# Altium project ECE453-Base.PrjPcb
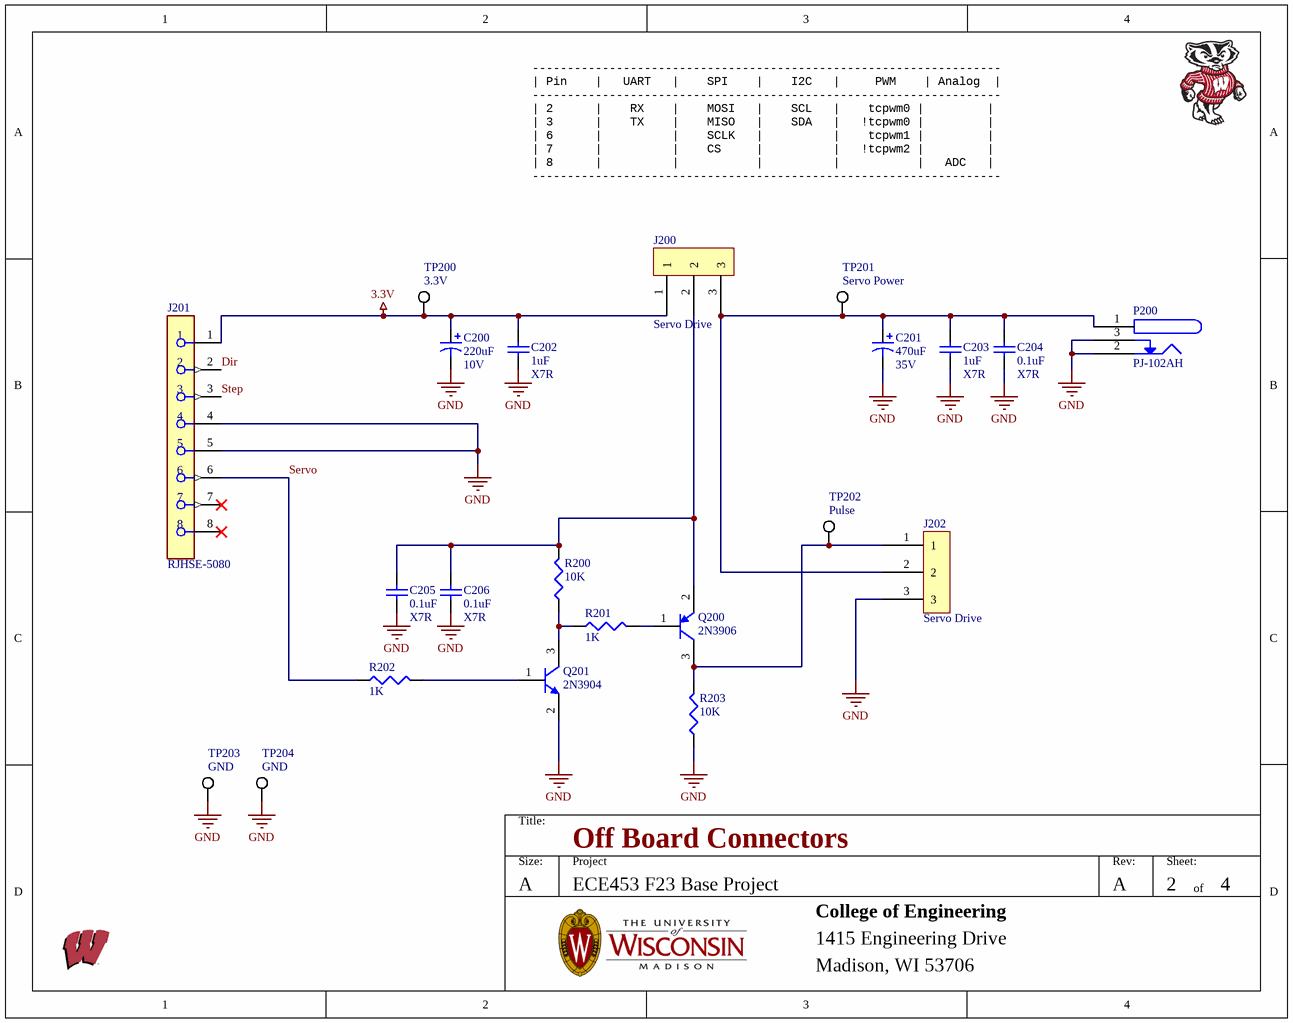
[diagram p0: 02_Connectors.SchDoc]
3 sheets, 75 parts. Net scope: global (net labels, ports and power ports of the same name join across sheets).
Board file: ECE453.PcbDoc
Sheets:
  02_Connectors.SchDoc
  03_ICs.SchDoc
  04_Mechanical.SchDoc

## Sheet 02_Connectors.SchDoc: Off Board Connectors
size A; Revision: A; SheetNumber: 2; SheetTotal: 4; ECE315_Project_Name: ECE453 F23 Base Project

### Parts
C200  Voltage: 10V  [CAPPR2-5x11]  (hidden comment: 220uF)
C201  Voltage: 35V  [CAPPR5-10x12.5]  (hidden comment: 470uF)
C202  Dielectric: X7R  [CAPC2012M]  (hidden comment: 1uF)
C203  Dielectric: X7R  [CAPC2012M]  (hidden comment: 1uF)
C204  Dielectric: X7R  [CAPC2012M]  (hidden comment: 0.1uF)
C205  Dielectric: X7R  [CAPC2012M]  (hidden comment: 0.1uF)
C206  Dielectric: X7R  [CAPC2012M]  (hidden comment: 0.1uF)
J200  Servo Drive  [3X1HDR]
J201  RJHSE-5080  [FP-RJHSE-5080-MFG]
J202  Servo Drive  [3X1HDR]
P200  Manufacturer Part Number: PJ-102AH  [PJ-102]  (hidden comment: PJ-102)
Q200  2N3906  [SOT23-3M]
Q201  2N3904  [SOT23-3M]
R200  10K  [RES_0805]
R201  value 1K  [RES_0805]  (hidden comment: 10K)
R202  value 1K  [RES_0805]  (hidden comment: 10K)
R203  10K  [RES_0805]
TP200  3.3V  [KSTN-5019_V]
TP201  Servo Power  [KSTN-5019_V]
TP202  Pulse  [KSTN-5019_V]
TP203  GND  [KSTN-5019_V]
TP204  GND  [KSTN-5019_V]

### Nets
3.3V: C200.1 C202.1 J200.1 J201.1 TP200.1
GND: C200.2 C201.2 C202.2 C203.1 C204.2 C205.2 C206.2 J201.4 J201.5 J202.3 P200.2 P200.3 Q201.2(E) R203.1 TP203.1 TP204.1
Dir: J201.2
Servo: J201.6 R202.1
Step: J201.3
NetC201_1: C201.1 C203.2 C204.1 J200.3 J202.2 P200.1 TP201.1
NetC205_1: C205.1 C206.1 J200.2 Q200.2(E) R200.2
NetJ202_1: J202.1 Q200.3(C) R203.2 TP202.1
NetQ200_1: Q200.1(B) R201.2
NetQ201_1: Q201.1(B) R202.2
NetQ201_3: Q201.3(C) R200.1 R201.1

Not connected (* = marked no-connect by the designer): J201 7* 8*

### Notes on the sheet
- -------------------------------------------------------------------
  | Pin    |   UART   |    SPI    |    I2C   |     PWM    | Analog  |
  -------------------------------------------------------------------
  | 2      |    RX    |    MOSI   |    SCL   |    tcpwm0 |         |
  | 3      |    TX    |    MISO   |    SDA   |   !tcpwm0 |         |
  | 6      |          |    SCLK   |          |    tcpwm1 |         |
  | 7      |          |    CS     |          |   !tcpwm2 |         |
  | 8      |          |           |          |           |   ADC   |
  -------------------------------------------------------------------
- Title:
- Size:
- A
- Project
- Rev:
- Sheet:
- of
- College of Engineering
- 1415 Engineering Drive
- Madison, WI 53706

### Library data of the parts
C200 = Cap Pol1_1: Capacitor Al 105deg 220uF 10V 5X11; Manufacturer: Rubycon; Manufacturer Part Number: 10YXJ220M5X11; Tolerance: 20%; Ripple Current: 250mA; Impedance: 400mR; Leakage Current: 3uA; Life (Hours): 4000Hour; Lead Diameter: 0.5mm; Value: 220uF; Supplier: Digi-Key; Supplier Part Number: 1189-4150-ND; RoHS: Yes; Category: Aluminum Electrolytic Capacitors; Stock 1: 94; Pricing 1: 1=0.26000, 10=0.17500, 50=0.11680, 100=0.09930, 500=0.07010, 1000=0.06134, 2500=0.05842, 5000=0.05404 (USD); Mount: Through Hole; Case/Package: Radial; Min Operating Temperature: -40°C; Max Operating Temperature: 105°C; Capacitance: 220uF; Termination: Radial; Package Quantity: 3000; Packaging: Bulk; Voltage Rating: 10V; Series: YXJ; Construction: RADIAL; Diameter: 5mm; Height: 11mm; Lead Pitch: 2mm; Height - Seated (Max): 0.492inch; Radiation Hardening: No; RoHS Compliant: Yes; ComponentLink1URL: https://datasheet.ciiva.com/11777/0900766b810307a1-11777018.pdf?src-supplier=RSComponents; ComponentLink1Description: https://datasheet.ciiva.com/11777/0900766b810307a1-11777018.pdf?src-supplier=RSComponents; ComponentLink2URL: https://datasheet.ciiva.com/6318/e-yxj-6318863.pdf?src-supplier=Digi-Key; ComponentLink2Description: https://datasheet.ciiva.com/6318/e-yxj-6318863.pdf?src-supplier=Digi-Key; ComponentLink3URL: https://datasheet.ciiva.com/11690/e-yxj-11690699.pdf?src-supplier=Avnet; ComponentLink3Description: https://datasheet.ciiva.com/11690/e-yxj-11690699.pdf?src-supplier=Avnet
C201 = Cap Pol3_1: CAP ALUM 470UF 20% 35V RADIAL; Manufacturer: Rubycon; Manufacturer Part Number: 35ZL470MEFC10X20; Leakage Current: 3uA; Lead Diameter: 0.6mm; Dielectric Material: Aluminium; Life (Hours): 4000Hour; Ripple Current: 1.82A; Impedance: 23mR; Value: 470uF; Case/Package: Radial; Max Operating Temperature: 105°C; REACH SVHC: Unknown; Min Operating Temperature: -40°C; Supplier Part Number: 35ZL470MEFC10X20-ND; Packaging: Bulk; Lead Pitch: 5mm; Diameter: 10mm; Capacitance: 470uF; Lead Free: Lead Free; Radiation Hardening: No; Package Quantity: 1000; Height: 20mm; Voltage Rating: 35V; Mount: Through Hole; Supplier: Digi-Key; Height - Seated (Max): 0.866inch; Tolerance: 20%; Termination: Radial
C202 = Cap_5: CAP CER 1UF 50V X7R 0805; Manufacturer: Samsung; Manufacturer Part Number: CL21B105KBFNNNE; Tolerance: 10%; Dielectric Material: Ceramic; Value: 1uF; Case Code (Metric): 2012; Min Operating Temperature: -55°C; Mount: Surface Mount; Width: 0.049inch; Voltage Rating (DC): 50V; Voltage Rating: 50V; Height: 1.25mm; Case Code (Imperial): 0805; Supplier: Digi-Key; Supplier Part Number: 1276-1029-6-ND; Capacitance: 1uF; Case/Package: 0805; Construction: Flat; Max Operating Temperature: 125°C; REACH SVHC: No SVHC; Voltage: 50V; Packaging: Tape and Reel; Depth: 1.25mm; Package Quantity: 1; Radiation Hardening: No; Series: CL; Length: 2mm; Thickness: 0.053inch; Termination: SMD/SMT; Number of Pins: 2; RoHS Compliant: Yes
C203 = Cap: CAP CER 1UF 50V X7R 0805; Manufacturer: Samsung; Manufacturer Part Number: CL21B105KBFNNNE; Tolerance: 10%; Dielectric Material: Ceramic; Case Code (Metric): 2012; Min Operating Temperature: -55°C; Mount: Surface Mount; Width: 0.049inch; Voltage Rating (DC): 50V; Voltage Rating: 50V; Height: 1.25mm; Case Code (Imperial): 0805; Supplier: Digi-Key; Supplier Part Number: 1276-1029-6-ND; Capacitance: 1uF; Case/Package: 0805; Construction: Flat; Max Operating Temperature: 125°C; REACH SVHC: No SVHC; Voltage: 50V; Packaging: Tape and Reel; Depth: 1.25mm; Package Quantity: 1; Radiation Hardening: No; Series: CL; Length: 2mm; Thickness: 0.053inch; Termination: SMD/SMT; Number of Pins: 2; RoHS Compliant: Yes; Value: 1uF
C204-C206 = Cap_1: Cap Ceramic 0.1uF 50V X7R 20% SMD 0805 125°C Plastic T/R; Manufacturer: KEMET; Manufacturer Part Number: C0805C104M5RAC7210; Supplier: Digi-Key; Supplier Part Number: 399-C0805C104M5RAC7210CT-ND; RoHS: Yes; Category: Ceramic Capacitors; Stock 1: 29705; Pricing 1: 1=0.10000, 10=0.05900, 50=0.03220, 100=0.02620, 500=0.01874, 1000=0.01472, 2500=0.01338, 5000=0.01231 (USD); Mounting Technology: Surface Mount; Case/Package: 0805; Dielectric Material: Ceramic; Min Operating Temperature: -55°C; Max Operating Temperature: 125°C; Packaging: Tape and Reel; Tolerance: 20%; Voltage Rating (DC): 50V; Construction: Flat; Length: 2mm; Height: 0.9mm; Depth: 1.25mm; Radiation Hardening: No; RoHS Compliant: Yes; ComponentLink1URL: https://datasheet.ciiva.com/26923/getdatasheetpartid-738954-26923963.pdf?src-supplier=Verical; ComponentLink1Description: https://datasheet.ciiva.com/26923/getdatasheetpartid-738954-26923963.pdf?src-supplier=Verical; Value: 0.1uF
J200 J202 = 3-Pin_1: Switch Slide N.O./N.C. SPDT Top Slide 0.2A 30VDC PC Pins Thru-Hole; Manufacturer: E-Switch; Manufacturer Part Number: EG1218; Voltage Rating (DC): 30V; Electrical Life: 10000Cycles; Switch Travel: 2.5mm; Switch Function: On-On; Actuator Type: Standard; Contact Current Rating: 200mA; Operating Force: 250gf; Illumination Type: Non-Illuminated; Number of Positions: 2; Insulation Resistance: 100R; Contact Resistance: 20mR; Actuator Length: 2mm; Supplier 1: Digi-Key; Supplier Part Number 1: EG1903-ND; RoHS: Yes; Category: Slide Switches; Stock 1: 46638; Pricing 1: 1=0.74, 25=0.6664, 100=0.5958, 500=0.5047, 2500=0.42434 (USD); Mounting Technology: Through Hole; Pins: 3; Contact Material: Copper Alloy,Copper,Silver; Contact Plating: Silver; Min Operating Temperature: -20°C; Max Operating Temperature: 70°C; Throw Configuration: SPDT; Termination: PC Pin; Packaging: Bulk; Orientation: Straight; Series: EG; Voltage Rating (AC): 30V; Voltage Rating: 30V; Lead Free: Lead Free; RoHS Compliant: Yes; Reach SVHC Compliant: No; ComponentLink1URL: https://datasheet.ciiva.com/1699/p040040c-1699451.pdf?src-supplier=Newark; ComponentLink1Description: https://datasheet.ciiva.com/1699/p040040c-1699451.pdf?src-supplier=Newark
J201 = CMP-02366-000003-1: CONN MOD JACK 8P8C R/A UNSHLD; Manufacturer: Amphenol; Current Rating: 1.5A; Voltage Rating: 125V; Pitch: 1.02mm; Conn Orientation: Right Angle; Number Of Contacts: 8; Is Female: yes; Conn Gender: Female; Contact Resistance: 20mR; Number of Ports: 1; Connector Type: RJ45; Lead Free: Yes; Device Class L3: unset; Footprint Url: https://cdn.amphenol-icc.com/media/wysiwyg/files/drawing/rjhse5080.pdf?__cf_chl_jschl_tk__=e349db0bbbb6188a39347cd5e541b92fa02c9719-1587748343-0-AW7tChdeHzRPLX9gSWj7WrKaXQoY9BsmT9Ek0h-T62M9y3Rs9iypFcOtkzb-6sGYQEjFE-jcoNciDETCOZrh1rYyOesac5SvYLoLwHIsHvF4AKBlx-MXmfZUVk9OTTJLqyQq2qMm0PFRLJpNcK0nrKResqOniRSYixG2sPTmOPraH-ULJFBDL602CHqcI9KKBgTq90Jh1OL2Td4moJ99rFsJRJ1Tk_uoxGe8ublcP_ARu-uLpWcQrBcwOcHDTAwL29DAwVaqcH7ta8Ks7WMlHmVl_pILeEDwT0bE9vu5Pa5S3PtNRF1leuFkgi_FMbUxTDulc5xzbXSfng8srUIV1lWXny5nx1fZJEUa_w97yKjffzBMxiWLWVN-V7-uqAaPbyv_m-wRyw5O25OZNyJOeGU; ComponentLink2URL: https://cdn.amphenol-icc.com/media/wysiwyg/files/documentation/datasheet/inputoutput/io-modjack-rjhse.pdf; Device Class L1: Connectors; Package: CONN_MOD_JACK; Mouser Description: Modular Connectors / Ethernet Connectors R/A RJ45 NONSHIELDED 8 CONT NO LEDS; Manufacturer Part Number: RJHSE-5080; Octopart: https://octopart.com/rjhse-5080-amphenol-45060; Category: Conn; Height: 0.535inch; Temperature: -55°C to +85°C; Digikey Description: CONN MOD JACK 8P8C R/A UNSHLD; Device Class L2: Modular / Ethernet Connectors; Contact Material: Gold,Nickel; ComponentLink2Description: Datasheet; Temperature Range Low: -55°C; RoHS: TRUE; Automotive: No; Temperature Range High: +85°C; Supplier: Newark; Supplier Part Number: 28T0105; Stock: 8640; Pricing: 1=0.966, 10=0.854, 25=0.808, 50=0.777, 100=0.748, 250=0.688, 500=0.627, 1000=0.568 (USD); Mounting Technology: Through Hole,Panel; Contact Plating: Gold; Max Current Rating: 1.5A; Number of Positions Loaded: 8; Max Voltage Rating (AC): 125V; Orientation: Right Angle; Packaging: Rail/Tube; Gender: Female; Termination: Solder; Number of Positions: 8; Voltage Rating (DC): 125V; Length: 15.75mm; Depth: 14.99mm; Radiation Hardening: No; RoHS Compliant: Yes; Reach SVHC Compliant: Unknown; ComponentLink1URL: https://datasheet.ciiva.com/7629/1682821-7629402.pdf?src-supplier=Element14; ComponentLink1Description: https://datasheet.ciiva.com/7629/1682821-7629402.pdf?src-supplier=Element14; ComponentLink3URL: https://datasheet.ciiva.com/685/rjhse5080-685586.pdf?src-supplier=Digi-Key; ComponentLink3Description: https://datasheet.ciiva.com/685/rjhse5080-685586.pdf?src-supplier=Digi-Key; ComponentLink4URL: https://datasheet.ciiva.com/1432/1693748-1432448.pdf?src-supplier=Element14; ComponentLink4Description: https://datasheet.ciiva.com/1432/1693748-1432448.pdf?src-supplier=Element14; ComponentLink5URL: https://datasheet.ciiva.com/15171/getdatasheetpartid-643190-15171163.pdf?src-supplier=Verical; ComponentLink5Description: https://datasheet.ciiva.com/15171/getdatasheetpartid-643190-15171163.pdf?src-supplier=Verical
P200 = CONN JACK PWR W/SW: CONN PWR JACK 2.1X5.5MM HIGH CUR; Manufacturer: CUI Inc; Internal Switch(s): Single Switch, Normally Closed; Number of Positions/Contacts: 2 Conductors, 3 Contacts; Plug/Mating Plug Diameter: 2.1mm ID, 5.5mm OD; Gender: Male; Shielding: Unshielded; Voltage - Rated: 24VDC; Current Rating: 5A; Value: CP-102AD; Mounting Type: Through Hole, Right Angle; Supplier: Digi-Key; Connector Type: Jack; Supplier Part Number: CP-102AH-ND; Termination: Solder; Contact Material: Copper; Housing Material: Thermoplastic; Contact Material - Plating: Nickel; Housing Color: Black; Operating Temperature: -25°C ~ 85°C; Color: Black
Q200 = 2N3906: TRANS PNP 40V 0.2A SOT23; Manufacturer Part Number: MMBT3906LT1G; Manufacturer: ON Semiconductor; Current - Collector (Ic) (Max): 200mA; Vce Saturation (Max) @ Ib, Ic: 400mV @ 5mA, 50mA; DC Current Gain (hFE) (Min) @ Ic, Vce: 100 @ 10mA, 1V; Power - Max: 300mW; Frequency - Transition: 250MHz; Transistor Type: PNP; Category: Discrete Semiconductor Products; RoHS: RoHS Compliant; Supplier: Digi-Key; Supplier Part Number: MMBT3906LT1GOSCT-ND; Packaging: Cut Tape (CT); Voltage - Collector Emitter Breakdown (Max): 40V; Mounting Type: Surface Mount; Supplier Device Package: SOT-23-3 (TO-236); Package / Case: TO-236-3, SC-59, SOT-23-3; Value: 2N3906
Q201 = 2N3904: NPN General Purpose Amplifier; Manufacturer Part Number: MMBT3904-7-F; Manufacturer: Diodes Incorporated; Frequency - Transition: 300MHz; Power - Max: 300mW; DC Current Gain (hFE) (Min) @ Ic, Vce: 100 @ 10mA, 1V; Current - Collector Cutoff (Max): 50nA (ICBO); Vce Saturation (Max) @ Ib, Ic: 300mV @ 5mA, 50mA; Voltage - Collector Emitter Breakdown (Max): 40V; Current - Collector (Ic) (Max): 200mA; Supplier Device Package: SOT-23-3; Mounting Type: Surface Mount; Transistor Type: NPN; Packaging: Cut Tape (CT); RoHS: RoHS Compliant; Package / Case: TO-236-3, SC-59, SOT-23-3; Supplier Part Number: MMBT3904-FDICT-ND; Supplier: Digi-Key; Category: Discrete Semiconductor Products; Value: 2N3904
R200 R203 = Res3: Res Thick Film 0805 10K Ohm 1% 0.125W ±100ppm/°C Molded SMD Paper T/R; Manufacturer: Stackpole Electronics; Manufacturer Part Number: RMCF0805FT10K0; Power Rating: 125mW; ComponentLink1URL: https://datasheet.ciiva.com/15193/getdatasheetpartid-362046-15193525.pdf?src-supplier=Verical; ComponentLink1Description: https://datasheet.ciiva.com/15193/getdatasheetpartid-362046-15193525.pdf?src-supplier=Verical; Supplier 1: Digi-Key; Supplier Part Number 1: RMCF0805FT10K0CT-ND; RoHS: Yes; Category: Chip SMD Resistors; Stock 1: 3732463; Pricing 1: 1=0.10000, 10=0.02400, 100=0.00970, 1000=0.00437, 2500=0.00379 (USD); Mounting Technology: Surface Mount; Case/Package: 0805; Case Code (Metric): 2012; Case Code (Imperial): 0805; Contact Plating: Tin,Matte; Min Operating Temperature: -55°C; Max Operating Temperature: 155°C; Tolerance: 1%; Packaging: Tape and Reel; Resistor Type: Thick Film; Number of Terminations: 2; Temperature Coefficient: 100ppm/°C; Max Power Dissipation: 125mW; Features: Automotive AEC-Q200; Series: RMCF; Construction: Rectangular; Length: 2mm; Width: 0.049inch; Height: 0.026inch; Depth: 1.25mm; Radiation Hardening: No; Lead Free: Lead Free; Military Standard: Not; RoHS Compliant: Yes; Value: 10K
R201 R202 = Res3_1: Res Thick Film 0805 1K Ohm 1% 0.125W(1/8W) ±100ppm/C Pad SMD Automotive T/R; Manufacturer: Stackpole Electronics; Manufacturer Part Number: RMCF0805FT1K00; Power Rating: 125mW; Temperature Coefficient: 100ppm/°C; Supplier 1: Digi-Key; Supplier Part Number 1: RMCF0805FT1K00CT-ND; RoHS: Yes; Category: Chip SMD Resistors; Stock 1: 2773085; Pricing 1: 1=0.10000, 10=0.02400, 100=0.00970, 1000=0.00437, 2500=0.00379 (USD); Mounting Technology: Surface Mount; Case/Package: 0805; Case Code (Metric): 2012; Case Code (Imperial): 0805; Contact Plating: Tin,Matte; Min Operating Temperature: -55°C; Max Operating Temperature: 155°C; Tolerance: 1%; Packaging: Tape and Reel; Resistor Type: Thick Film; Number of Terminations: 2; Max Power Dissipation: 125mW; Features: Automotive AEC-Q200; Series: RMCF; Construction: Rectangular; Length: 2mm; Width: 0.049inch; Height: 0.026inch; Depth: 1.25mm; Radiation Hardening: No; Military Standard: Not; Lead Free: Lead Free; RoHS Compliant: Yes; ComponentLink1URL: https://datasheet.ciiva.com/15193/getdatasheetpartid-360136-15193546.pdf?src-supplier=Verical; ComponentLink1Description: https://datasheet.ciiva.com/15193/getdatasheetpartid-360136-15193546.pdf?src-supplier=Verical
TP200-TP204 = CMP-1672-00008-1: Test Point, 1 Position SMD, RoHS, Tape and Reel; Manufacturer: Keystone Electronics; Manufacturer Part Number: 5019; Plating: Silver; Body Material: Bronze; Supplier: Newark; Supplier Part Number: 59Y8500; RoHS: Yes; Category: Connectors; Stock: 11269; Pricing: 1=0.411, 10=0.389, 25=0.285, 50=0.279, 100=0.273, 250=0.246 (USD); Mounting Technology: Surface Mount,PCB; Pins: 1; Contact Plating: Silver; Contact Material: Bronze; Material: Bronze; Packaging: Tape and Reel; Package Quantity: 1; Termination: SMD/SMT; Series: 5019; Height: 0.09inch; Reach SVHC Compliant: No; RoHS Compliant: Yes; Lead Free: Lead Free; ComponentLink1URL: https://datasheet.ciiva.com/14848/m60-2p61-14848437.pdf?src-supplier=Digi-Key; ComponentLink1Description: https://datasheet.ciiva.com/14848/m60-2p61-14848437.pdf?src-supplier=Digi-Key; ComponentLink2URL: https://datasheet.ciiva.com/14848/m60-2p61-14848438.pdf?src-supplier=Digi-Key; ComponentLink2Description: https://datasheet.ciiva.com/14848/m60-2p61-14848438.pdf?src-supplier=Digi-Key; ComponentLink3URL: https://datasheet.ciiva.com/14848/m60-2p61-14848439.pdf?src-supplier=Digi-Key; ComponentLink3Description: https://datasheet.ciiva.com/14848/m60-2p61-14848439.pdf?src-supplier=Digi-Key; ComponentLink4URL: https://datasheet.ciiva.com/16318/m60-2p61-16318395.pdf?src-supplier=Future+Electronics; ComponentLink4Description: https://datasheet.ciiva.com/16318/m60-2p61-16318395.pdf?src-supplier=Future+Electronics; ComponentLink5URL: https://datasheet.ciiva.com/16885/70182998-16885945.pdf?src-supplier=Allied+Electronics; ComponentLink5Description: https://datasheet.ciiva.com/16885/70182998-16885945.pdf?src-supplier=Allied+Electronics

## Sheet 03_ICs.SchDoc: ICs
size A; Revision: A; SheetNumber: 3; SheetTotal: 4; ECE315_Project_Name: ECE453 F23 Base Project
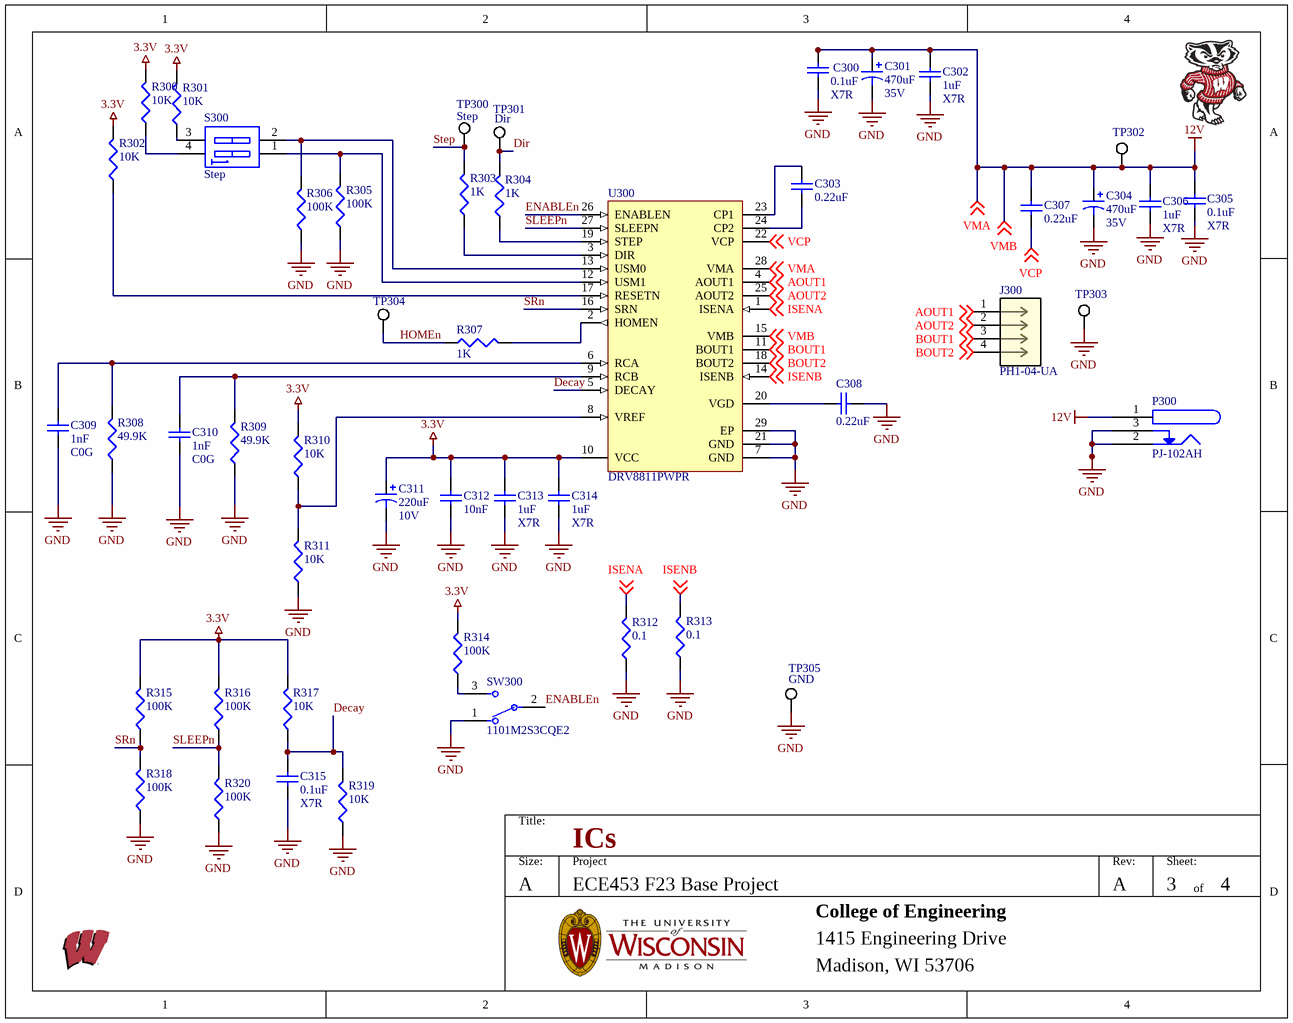
[diagram p1: 03_ICs.SchDoc]

### Parts
C300  Dielectric: X7R  [CAPC2012M]  (hidden comment: 0.1uF)
C301  Voltage: 35V  [CAPPR5-10x12.5]  (hidden comment: 470uF)
C302  Dielectric: X7R  [CAPC2012M]  (hidden comment: 1uF)
C303  0.22uF  [CAP_0805]
C304  Voltage: 35V  [CAPPR5-10x12.5]  (hidden comment: 470uF)
C305  Dielectric: X7R  [CAPC2012M]  (hidden comment: 0.1uF)
C306  Dielectric: X7R  [CAPC2012M]  (hidden comment: 1uF)
C307  0.22uF  [CAPC2012M]
C308  0.22uF  [CAP_0805]
C309  value 1nF  Dielectric: C0G  [CAP_0805]  (hidden comment: Cap)
C310  value 1nF  Dielectric: C0G  [CAP_0805]  (hidden comment: Cap)
C311  Voltage: 10V  [CAPPR2-5x11]  (hidden comment: 220uF)
C312  10nF  [CAP_0805]
C313  Dielectric: X7R  [CAPC2012M]  (hidden comment: 1uF)
C314  Dielectric: X7R  [CAPC2012M]  (hidden comment: 1uF)
C315  Dielectric: X7R  [CAPC2012M]  (hidden comment: 0.1uF)
J300  PH1-04-UA  [CONN_PH1-04-UA_ADM]
P300  Manufacturer Part Number: PJ-102AH  [PJ-102]  (hidden comment: PJ-102)
R300  10K  [RES_0805]
R301  10K  [RES_0805]
R302  10K  [RES_0805]
R303  value 1K  [RES_0805]  (hidden comment: 10K)
R304  value 1K  [RES_0805]  (hidden comment: 10K)
R305  value 100K  [RES_0805]  (hidden comment: 13K)
R306  value 100K  [RES_0805]  (hidden comment: 13K)
R307  value 1K  [RES_0805]  (hidden comment: 10K)
R308  49.9K  [RES_0805]
R309  49.9K  [RES_0805]
R310  10K  [RES_0805]
R311  10K  [RES_0805]
R312  value 0.1  [RES_0805]  (hidden comment: 1)
R313  value 0.1  [RES_0805]  (hidden comment: 1)
R314  value 100K  [RES_0805]  (hidden comment: 13K)
R315  value 100K  [RES_0805]  (hidden comment: 13K)
R316  value 100K  [RES_0805]  (hidden comment: 13K)
R317  10K  [RES_0805]
R318  value 100K  [RES_0805]  (hidden comment: 13K)
R319  10K  [RES_0805]
R320  value 100K  [RES_0805]  (hidden comment: 13K)
S300  Step  [DIP-4]
SW300  1101M2S3CQE2  [FP-1101M2S3CQE2-MFG]
TP300  Step  [KSTN-5019_V]
TP301  Dir  [KSTN-5019_V]
TP302  5019  [KSTN-5019_V]  (value not drawn)
TP303  5019  [KSTN-5019_V]  (value not drawn)
TP304  5019  [KSTN-5019_V]  (value not drawn)
TP305  GND  [KSTN-5019_V]
U300  DRV8811PWPR  [PWP0028C_M]

### Nets
3.3V: C311.1 C312.2 C313.2 C314.2 R300.2 R301.2 R302.2 R310.2 R314.2 R315.2 R316.2 R317.2 U300.10(VCC)
12V: C300.2 C301.1 C302.2 C304.1 C305.2 C306.2 C307.2 P300.1 TP302.1 U300.15(VMB) U300.28(VMA) ; off-sheet VMA, off-sheet VMB  [also labelled VMA, VMB]
GND: C300.1 C301.2 C302.1 C304.2 C305.1 C306.1 C308.2 C309.1 C310.1 C311.2 C312.1 C313.1 C314.1 C315.1 P300.2 P300.3 R305.1 R306.1 R308.1 R309.1 R311.1 R312.1 R313.1 R318.1 R319.1 R320.1 SW300.1 TP303.1 TP305.1 U300.7(GND) U300.21(GND) U300.29(EP)
AOUT1: J300.1 U300.4(AOUT1) ; off-sheet AOUT1
AOUT2: J300.2 U300.25(AOUT2) ; off-sheet AOUT2
BOUT1: J300.3 U300.11(BOUT1) ; off-sheet BOUT1
BOUT2: J300.4 U300.18(BOUT2) ; off-sheet BOUT2
Decay: C315.2 R317.1 R319.2 U300.5(DECAY)
Dir: R304.2 TP301.1
ENABLEn: SW300.2(COMM) U300.26(ENABLEN)
HOMEn: R307.1 TP304.1
ISENA: R312.2 U300.1(ISENA) ; off-sheet ISENA
ISENB: R313.2 U300.14(ISENB) ; off-sheet ISENB
SLEEPn: R316.1 R320.2 U300.27(SLEEPN)
SRn: R315.1 R318.2 U300.16(SRN)
Step: R303.2 TP300.1
VCP: C307.1 U300.22(VCP) ; off-sheet VCP
NetC303_1: C303.1 U300.24(CP2)
NetC303_2: C303.2 U300.23(CP1)
NetC308_1: C308.1 U300.20(VGD)
NetC309_2: C309.2 R308.2 U300.6(RCA)
NetC310_2: C310.2 R309.2 U300.9(RCB)
NetR300_1: R300.1 S300.4(B1)
NetR301_1: R301.1 S300.3(B2)
NetR302_1: R302.1 U300.17(RESETN)
NetR303_1: R303.1 U300.3(DIR)
NetR304_1: R304.1 U300.19(STEP)
NetR305_2: R305.2 S300.1(A1) U300.12(USM1)
NetR306_2: R306.2 S300.2(A2) U300.13(USM0)
NetR307_2: R307.2 U300.2(HOMEN)
NetR310_1: R310.1 R311.2 U300.8(VREF)
NetR314_1: R314.1 SW300.3

### Notes on the sheet
- Title:
- Size:
- A
- Project
- Rev:
- Sheet:
- of
- College of Engineering
- 1415 Engineering Drive
- Madison, WI 53706

### Library data of the parts
C300 C305 C315 = Cap_1: as C204 on sheet 02_Connectors; Supplier: Digi-Key; Supplier Part Number: 399-C0805C104M5RAC7210CT-ND; RoHS: Yes; Category: Ceramic Capacitors; Stock 1: 29705; Pricing 1: 1=0.10000, 10=0.05900, 50=0.03220, 100=0.02620, 500=0.01874, 1000=0.01472, 2500=0.01338, 5000=0.01231 (USD); Mounting Technology: Surface Mount; Case/Package: 0805; Dielectric Material: Ceramic; Min Operating Temperature: -55°C; Max Operating Temperature: 125°C; Packaging: Tape and Reel; Tolerance: 20%; Voltage Rating (DC): 50V; Construction: Flat; Length: 2mm; Height: 0.9mm; Depth: 1.25mm; Radiation Hardening: No; RoHS Compliant: Yes; ComponentLink1URL: https://datasheet.ciiva.com/26923/getdatasheetpartid-738954-26923963.pdf?src-supplier=Verical; ComponentLink1Description: https://datasheet.ciiva.com/26923/getdatasheetpartid-738954-26923963.pdf?src-supplier=Verical; Value: 0.1uF
C301 C304 = Cap Pol3_1: as C201 on sheet 02_Connectors; Value: 470uF; Case/Package: Radial; Max Operating Temperature: 105°C; REACH SVHC: Unknown; Min Operating Temperature: -40°C; Supplier Part Number: 35ZL470MEFC10X20-ND; Packaging: Bulk; Lead Pitch: 5mm; Diameter: 10mm; Capacitance: 470uF; Lead Free: Lead Free; Radiation Hardening: No; Package Quantity: 1000; Height: 20mm; Voltage Rating: 35V; Mount: Through Hole; Supplier: Digi-Key; Height - Seated (Max): 0.866inch; Tolerance: 20%; Termination: Radial
C302 C306 C313 C314 = Cap: as C203 on sheet 02_Connectors; Case Code (Metric): 2012; Min Operating Temperature: -55°C; Mount: Surface Mount; Width: 0.049inch; Voltage Rating (DC): 50V; Voltage Rating: 50V; Height: 1.25mm; Case Code (Imperial): 0805; Supplier: Digi-Key; Supplier Part Number: 1276-1029-6-ND; Capacitance: 1uF; Case/Package: 0805; Construction: Flat; Max Operating Temperature: 125°C; REACH SVHC: No SVHC; Voltage: 50V; Packaging: Tape and Reel; Depth: 1.25mm; Package Quantity: 1; Radiation Hardening: No; Series: CL; Length: 2mm; Thickness: 0.053inch; Termination: SMD/SMT; Number of Pins: 2; RoHS Compliant: Yes; Value: 1uF
C303 C307 C308 = Cap_2: Cap Ceramic 0.22uF 50V X7R 10% SMD 0805 125°C Plastic T/R; Manufacturer: KEMET; Manufacturer Part Number: C0805C224K5RACAUTO7210; Supplier 1: Digi-Key; Supplier Part Number 1: 399-C0805C224K5RACAUTO7210CT-ND; RoHS: Yes; Category: Ceramic Capacitors; Stock 1: 24243; Pricing 1: 1=0.19000, 10=0.12800, 50=0.07680, 100=0.06490, 500=0.04438, 1000=0.03926, 2500=0.03755, 5000=0.03414 (USD); RoHS Compliant: Yes; Value: 0.22uF
C309 C310 = Cap_3: Cap Ceramic 0.001uF 50V C0G 5% SMD 0805 125°C Punched Paper T/R; Manufacturer: KEMET; Manufacturer Part Number: C0805C102J5GAC7210; Supplier 1: Digi-Key; Supplier Part Number 1: 399-C0805C102J5GAC7210CT-ND; RoHS: Yes; Category: Ceramic Capacitors; Stock 1: 8034; Pricing 1: 1=0.11000, 10=0.07600, 50=0.04300, 100=0.03560, 500=0.02496, 1000=0.02066, 2500=0.01922, 5000=0.01759 (USD); Mounting Technology: Surface Mount; Case/Package: 0805; Contact Plating: Tin,Matte; Dielectric Material: Ceramic; Min Operating Temperature: -55°C; Max Operating Temperature: 125°C; Tolerance: 5%; Packaging: Tape and Reel; Voltage Rating (DC): 50V; Termination: Wraparound; Construction: Flat; Length: 2mm; Height: 0.78mm; Depth: 1.25mm; Radiation Hardening: No; Lead Free: Lead Free; RoHS Compliant: Yes; ComponentLink1URL: https://datasheet.ciiva.com/11627/kem-c1003-c0g-smd-11627691.pdf?src-supplier=Avnet; ComponentLink1Description: https://datasheet.ciiva.com/11627/kem-c1003-c0g-smd-11627691.pdf?src-supplier=Avnet; ComponentLink2URL: https://datasheet.ciiva.com/26823/getdatasheetpartid-55943-26823002.pdf?src-supplier=Verical; ComponentLink2Description: https://datasheet.ciiva.com/26823/getdatasheetpartid-55943-26823002.pdf?src-supplier=Verical
C311 = Cap Pol1_1: as C200 on sheet 02_Connectors; Value: 220uF; Supplier: Digi-Key; Supplier Part Number: 1189-4150-ND; RoHS: Yes; Category: Aluminum Electrolytic Capacitors; Stock 1: 94; Pricing 1: 1=0.26000, 10=0.17500, 50=0.11680, 100=0.09930, 500=0.07010, 1000=0.06134, 2500=0.05842, 5000=0.05404 (USD); Mount: Through Hole; Case/Package: Radial; Min Operating Temperature: -40°C; Max Operating Temperature: 105°C; Capacitance: 220uF; Termination: Radial; Package Quantity: 3000; Packaging: Bulk; Voltage Rating: 10V; Series: YXJ; Construction: RADIAL; Diameter: 5mm; Height: 11mm; Lead Pitch: 2mm; Height - Seated (Max): 0.492inch; Radiation Hardening: No; RoHS Compliant: Yes; ComponentLink1URL: https://datasheet.ciiva.com/11777/0900766b810307a1-11777018.pdf?src-supplier=RSComponents; ComponentLink1Description: https://datasheet.ciiva.com/11777/0900766b810307a1-11777018.pdf?src-supplier=RSComponents; ComponentLink2URL: https://datasheet.ciiva.com/6318/e-yxj-6318863.pdf?src-supplier=Digi-Key; ComponentLink2Description: https://datasheet.ciiva.com/6318/e-yxj-6318863.pdf?src-supplier=Digi-Key; ComponentLink3URL: https://datasheet.ciiva.com/11690/e-yxj-11690699.pdf?src-supplier=Avnet; ComponentLink3Description: https://datasheet.ciiva.com/11690/e-yxj-11690699.pdf?src-supplier=Avnet
C312 = Cap_4: Cap Ceramic 0.01uF 100V X7R 10% SMD 0805 125°C Plastic T/R; Manufacturer: KEMET; Manufacturer Part Number: C0805C103K1RAC7210; Supplier 1: Digi-Key; Supplier Part Number 1: 399-17617-1-ND; RoHS: Yes; Category: Ceramic Capacitors; Stock 1: 464939; Pricing 1: 1=0.10000, 10=0.05400, 50=0.02960, 100=0.02430, 500=0.01732, 1000=0.01361, 2500=0.01237, 5000=0.01138 (USD); Mounting Technology: Surface Mount; Case/Package: 0805; Case Code (Imperial): 0805; Case Code (Metric): 2012; Dielectric Material: Ceramic; Min Operating Temperature: -55°C; Max Operating Temperature: 125°C; Tolerance: 10%; Packaging: Tape and Reel; Package Quantity: 10000; Voltage Rating: 100V; Voltage Rating (DC): 100V; Dielectric: X7R; Termination: SMD/SMT; Series: C0805C; Construction: Flat; Length: 2mm; Height: 0.78mm; Depth: 1.25mm; Radiation Hardening: No; RoHS Compliant: Yes; ComponentLink1URL: http://www.farnell.com/datasheets/2747800.pdf?src-supplier=Farnell; ComponentLink1Description: http://www.farnell.com/datasheets/2747800.pdf?src-supplier=Farnell; ComponentLink2URL: http://www.mouser.com/ds/2/212/KEM_C1002_X7R_SMD-1102033.pdf?src-supplier=Mouser; ComponentLink2Description: http://www.mouser.com/ds/2/212/KEM_C1002_X7R_SMD-1102033.pdf?src-supplier=Mouser; ComponentLink3URL: http://components.arrow.com/part/dataview/2091052S6675795N7429?src-supplier=Arrow+Electronics; ComponentLink3Description: http://components.arrow.com/part/dataview/2091052S6675795N7429?src-supplier=Arrow+Electronics; ComponentLink4URL: https://www.verical.com/server-webapp/html/getDatasheet?partID=131027&src-supplier=Verical; ComponentLink4Description: https://www.verical.com/server-webapp/html/getDatasheet?partID=131027&src-supplier=Verical; ComponentLink5URL: http://www.kemet.com/kemet/web/homepage/kechome.nsf/weben/C4DA2DA1D1C9D3C3CA2570A50016092D/$file/KEM_C1002_X7R_SMD.pdf?src-supplier=Avnet; ComponentLink5Description: http://www.kemet.com/kemet/web/homepage/kechome.nsf/weben/C4DA2DA1D1C9D3C3CA2570A50016092D/$file/KEM_C1002_X7R_SMD.pdf?src-supplier=Avnet; ComponentLink6URL: https://api.kemet.com/component-edge/download/datasheet/C0805C103K1RAC7210.pdf?src-supplier=Digi-Key; ComponentLink6Description: https://api.kemet.com/component-edge/download/datasheet/C0805C103K1RAC7210.pdf?src-supplier=Digi-Key; ComponentLink7URL: http://www.farnell.com/datasheets/2747800.pdf?src-supplier=Newark; ComponentLink7Description: http://www.farnell.com/datasheets/2747800.pdf?src-supplier=Newark; ComponentLink8URL: http://www.kemet.com/kemet/web/homepage/kechome.nsf/weben/C4DA2DA1D1C9D3C3CA2570A50016092D/$file/KEM_C1002_X7R_SMD.pdf; ComponentLink8Description: http://www.kemet.com/kemet/web/homepage/kechome.nsf/weben/C4DA2DA1D1C9D3C3CA2570A50016092D/$file/KEM_C1002_X7R_SMD.pdf; Value: 10nF
J300 = PH1-04-UA: No Description Available; Mfr_Name: ADAM TECHNOLOGIES INC; Copyright: Copyright (C) 2023 Ultra Librarian. All rights reserved.; Manufacturer_Part_Number: PH1-04-UA; Digi-Key_Part_Number_1: 2057-PH1-04-UA-ND; RefDes: RefDes; Type: DEV
P300 = CONN JACK PWR W/SW: as P200 on sheet 02_Connectors; Mounting Type: Through Hole, Right Angle; Supplier: Digi-Key; Connector Type: Jack; Supplier Part Number: CP-102AH-ND; Termination: Solder; Contact Material: Copper; Housing Material: Thermoplastic; Contact Material - Plating: Nickel; Housing Color: Black; Operating Temperature: -25°C ~ 85°C; Color: Black
R300-R302 R310 R311 R317 R319 = Res3: as R200 on sheet 02_Connectors; ComponentLink1URL: https://datasheet.ciiva.com/15193/getdatasheetpartid-362046-15193525.pdf?src-supplier=Verical; ComponentLink1Description: https://datasheet.ciiva.com/15193/getdatasheetpartid-362046-15193525.pdf?src-supplier=Verical; Supplier 1: Digi-Key; Supplier Part Number 1: RMCF0805FT10K0CT-ND; RoHS: Yes; Category: Chip SMD Resistors; Stock 1: 3732463; Pricing 1: 1=0.10000, 10=0.02400, 100=0.00970, 1000=0.00437, 2500=0.00379 (USD); Mounting Technology: Surface Mount; Case/Package: 0805; Case Code (Metric): 2012; Case Code (Imperial): 0805; Contact Plating: Tin,Matte; Min Operating Temperature: -55°C; Max Operating Temperature: 155°C; Tolerance: 1%; Packaging: Tape and Reel; Resistor Type: Thick Film; Number of Terminations: 2; Temperature Coefficient: 100ppm/°C; Max Power Dissipation: 125mW; Features: Automotive AEC-Q200; Series: RMCF; Construction: Rectangular; Length: 2mm; Width: 0.049inch; Height: 0.026inch; Depth: 1.25mm; Radiation Hardening: No; Lead Free: Lead Free; Military Standard: Not; RoHS Compliant: Yes; Value: 10K
R303 R304 R307 = Res3_1: as R201 on sheet 02_Connectors; Supplier 1: Digi-Key; Supplier Part Number 1: RMCF0805FT1K00CT-ND; RoHS: Yes; Category: Chip SMD Resistors; Stock 1: 2773085; Pricing 1: 1=0.10000, 10=0.02400, 100=0.00970, 1000=0.00437, 2500=0.00379 (USD); Mounting Technology: Surface Mount; Case/Package: 0805; Case Code (Metric): 2012; Case Code (Imperial): 0805; Contact Plating: Tin,Matte; Min Operating Temperature: -55°C; Max Operating Temperature: 155°C; Tolerance: 1%; Packaging: Tape and Reel; Resistor Type: Thick Film; Number of Terminations: 2; Max Power Dissipation: 125mW; Features: Automotive AEC-Q200; Series: RMCF; Construction: Rectangular; Length: 2mm; Width: 0.049inch; Height: 0.026inch; Depth: 1.25mm; Radiation Hardening: No; Military Standard: Not; Lead Free: Lead Free; RoHS Compliant: Yes; ComponentLink1URL: https://datasheet.ciiva.com/15193/getdatasheetpartid-360136-15193546.pdf?src-supplier=Verical; ComponentLink1Description: https://datasheet.ciiva.com/15193/getdatasheetpartid-360136-15193546.pdf?src-supplier=Verical
R305 R306 R314-R316 R318 R320 = Res3_4: Res Thick Film 0805 100K Ohm 1% 0.125W ±100ppm/°C Molded SMD Paper T/R; Manufacturer: Stackpole Electronics; Manufacturer Part Number: RMCF0805FT100K; Power Rating: 125mW; Working Voltage: 150V; Supplier 1: Digi-Key; Supplier Part Number 1: RMCF0805FT100KCT-ND; RoHS: Yes; Category: Chip SMD Resistors; Stock 1: 4530416; Pricing 1: 1=0.10000, 10=0.02400, 100=0.00970, 1000=0.00437, 2500=0.00379 (USD); Mounting Technology: Surface Mount; Case/Package: 0805; Case Code (Metric): 2012; Case Code (Imperial): 0805; Contact Plating: Tin,Matte; Min Operating Temperature: -55°C; Max Operating Temperature: 155°C; Tolerance: 1%; Packaging: Tape and Reel; Resistor Type: Thick Film; Number of Terminations: 2; Temperature Coefficient: 100ppm/°C; Max Power Dissipation: 125mW; Features: Automotive AEC-Q200; Series: RMCF; Construction: Rectangular; Technology: THICK FILM; Length: 2mm; Width: 0.049inch; Height: 0.026inch; Depth: 1.25mm; Radiation Hardening: No; Military Standard: Not; Lead Free: Lead Free; RoHS Compliant: Yes; ComponentLink1URL: http://components.arrow.com/part/dataview/50568053S7005095N1174?src-supplier=Arrow+Electronics; ComponentLink1Description: http://components.arrow.com/part/dataview/50568053S7005095N1174?src-supplier=Arrow+Electronics; ComponentLink2URL: https://www.seielect.com/catalog/SEI-RMCF_RMCP.pdf?src-supplier=Avnet; ComponentLink2Description: https://www.seielect.com/catalog/SEI-RMCF_RMCP.pdf?src-supplier=Avnet; ComponentLink3URL: http://www.onlinecomponents.com/productFiles/mf-SEI/sei-rmcp.pdf?src-supplier=Onlinecomponents.com; ComponentLink3Description: http://www.onlinecomponents.com/productFiles/mf-SEI/sei-rmcp.pdf?src-supplier=Onlinecomponents.com; ComponentLink4URL: http://www.seielect.com/catalog/sei-rmc.pdf?src-supplier=Future+Electronics; ComponentLink4Description: http://www.seielect.com/catalog/sei-rmc.pdf?src-supplier=Future+Electronics; ComponentLink5URL: https://www.verical.com/server-webapp/html/getDatasheet?partID=360692&src-supplier=Verical; ComponentLink5Description: https://www.verical.com/server-webapp/html/getDatasheet?partID=360692&src-supplier=Verical; ComponentLink6URL: https://www.seielect.com/catalog/SEI-Packaging.pdf?src-supplier=Digi-Key; ComponentLink6Description: https://www.seielect.com/catalog/SEI-Packaging.pdf?src-supplier=Digi-Key
R308 R309 = Res3_3: Res Thick Film 0805 49.9K Ohm 1% 0.125W ±100ppm/°C Molded SMD Paper T/R; Manufacturer: Stackpole Electronics; Manufacturer Part Number: RMCF0805FT49K9; Power Rating: 125mW; ComponentLink1URL: http://components.arrow.com/part/dataview/43746233S7171820N1174?src-supplier=Arrow+Electronics; ComponentLink1Description: http://components.arrow.com/part/dataview/43746233S7171820N1174?src-supplier=Arrow+Electronics; ComponentLink2URL: https://www.seielect.com/Catalog/SEI-RMCF_RMCP.pdf?src-supplier=Digi-Key; ComponentLink2Description: https://www.seielect.com/Catalog/SEI-RMCF_RMCP.pdf?src-supplier=Digi-Key; ComponentLink3URL: https://www.seielect.com/catalog/SEI-Packaging.pdf?src-supplier=Digi-Key; ComponentLink3Description: https://www.seielect.com/catalog/SEI-Packaging.pdf?src-supplier=Digi-Key; ComponentLink4URL: https://www.seielect.com/catalog/SEI-RMCF_RMCP.pdf?src-supplier=Avnet; ComponentLink4Description: https://www.seielect.com/catalog/SEI-RMCF_RMCP.pdf?src-supplier=Avnet; ComponentLink5URL: http://www.seielect.com/Catalog/SEI-RMC.pdf?src-supplier=Future+Electronics; ComponentLink5Description: http://www.seielect.com/Catalog/SEI-RMC.pdf?src-supplier=Future+Electronics; ComponentLink6URL: https://www.verical.com/server-webapp/html/getDatasheet?partID=362599&src-supplier=Verical; ComponentLink6Description: https://www.verical.com/server-webapp/html/getDatasheet?partID=362599&src-supplier=Verical; Supplier 1: Digi-Key; Supplier Part Number 1: RMCF0805FT49K9CT-ND; RoHS: Yes; Category: Chip SMD Resistors; Stock 1: 593081; Pricing 1: 1=0.10000, 10=0.02400, 100=0.00970, 1000=0.00437, 2500=0.00379 (USD); Mounting Technology: Surface Mount; Case/Package: 0805; Case Code (Metric): 2012; Case Code (Imperial): 0805; Contact Plating: Tin,Matte; Min Operating Temperature: -55°C; Max Operating Temperature: 155°C; Packaging: Tape and Reel; Tolerance: 1%; Package Quantity: 1; Resistor Type: Thick Film; Number of Terminations: 2; Max Power Dissipation: 125mW; Temperature Coefficient: 100ppm/°C; Features: Automotive AEC-Q200; Series: RMCF; Construction: Rectangular; Length: 2mm; Width: 0.049inch; Height: 0.026inch; Depth: 1.25mm; Radiation Hardening: No; Military Standard: Not; Lead Free: Lead Free; RoHS Compliant: Yes; Value: 49.9K
R312 R313 = Res3_2: Res 0.1 Ohm 1% 1W 1206; Manufacturer: Cyntec; Manufacturer Part Number: SCRR1206S1-R100F; Supplier 1: Digi-Key; Supplier Part Number 1: 2037-SCRR1206S1-R100FCT-ND; RoHS: Yes; Category: Chip SMD Resistors; Stock 1: 10585; Pricing 1: 1=0.61000, 10=0.45100, 25=0.36600, 50=0.31820, 100=0.26250, 250=0.22800, 500=0.18558, 1000=0.14720 (USD)
S300 = SW DIP-2: Switch DIP OFF ON SPST 2 Raised Slide 0.025A 24VDC PC Pins 2.54mm Thru-Hole Tube; Manufacturer: CUI Devices; Manufacturer Part Number: DS01-254-L-02BE; Value: DIP-SW-2Pos; Supplier 1: Digi-Key; Supplier Part Number 1: 2223-DS01-254-L-02BE-ND; RoHS: Yes; Category: DIP Switches; Stock 1: 12017; Pricing 1: 1=0.5, 10=0.483, 25=0.4648, 100=0.4022, 250=0.36648, 500=0.33966, 1000=0.30391, 2500=0.28782, 5000=0.26637 (USD)
SW300 = CMP-10038-000019-1: SWITCH SLIDE SPDT 6A 120V; Switch Travel: 2.16mm; Number of Positions: 3; Number of Poles: 1; Approvals: UL; Actuator Length: 5.08mm; Voltage Rating (DC): 28V; Max Voltage Rating (AC): 250V; Insulation Resistance: 1GR; Body Material: Stainless Steel; Actuator Type: Standard; Contact Resistance: 10mR; Switch Function: On-On; Actuator Material: Nylon; Actuator Color: Black; Electrical Life: 40000Cycles; Termination: PC Pins; Packaging: Bulk; Housing Material: Stainless Steel; Flammability Rating: UL94 V-0; Series: 1000; Contact Current Rating: 6A; Length: 12.7mm; Depth: 6.6mm; Orientation: Vertical; Max Current Rating: 6A; Max Operating Temperature: 65°C; Throw Configuration: SPDT; REACH SVHC: No SVHC; Contact Material: Copper; Max Voltage Rating (DC): 28V; Lead Free: Lead Free; Current Rating: 6A; Voltage Rating (AC): 120V; Contact Plating: Silver; Package Quantity: 1; Min Operating Temperature: -30°C; Mount: Through Hole
TP300 TP301 TP305 = CMP-1672-00008-1: as TP200 on sheet 02_Connectors; Supplier: Newark; Supplier Part Number: 59Y8500; RoHS: Yes; Category: Connectors; Stock: 11269; Pricing: 1=0.411, 10=0.389, 25=0.285, 50=0.279, 100=0.273, 250=0.246 (USD); Mounting Technology: Surface Mount,PCB; Pins: 1; Contact Plating: Silver; Contact Material: Bronze; Material: Bronze; Packaging: Tape and Reel; Package Quantity: 1; Termination: SMD/SMT; Series: 5019; Height: 0.09inch; Reach SVHC Compliant: No; RoHS Compliant: Yes; Lead Free: Lead Free; ComponentLink1URL: https://datasheet.ciiva.com/14848/m60-2p61-14848437.pdf?src-supplier=Digi-Key; ComponentLink1Description: https://datasheet.ciiva.com/14848/m60-2p61-14848437.pdf?src-supplier=Digi-Key; ComponentLink2URL: https://datasheet.ciiva.com/14848/m60-2p61-14848438.pdf?src-supplier=Digi-Key; ComponentLink2Description: https://datasheet.ciiva.com/14848/m60-2p61-14848438.pdf?src-supplier=Digi-Key; ComponentLink3URL: https://datasheet.ciiva.com/14848/m60-2p61-14848439.pdf?src-supplier=Digi-Key; ComponentLink3Description: https://datasheet.ciiva.com/14848/m60-2p61-14848439.pdf?src-supplier=Digi-Key; ComponentLink4URL: https://datasheet.ciiva.com/16318/m60-2p61-16318395.pdf?src-supplier=Future+Electronics; ComponentLink4Description: https://datasheet.ciiva.com/16318/m60-2p61-16318395.pdf?src-supplier=Future+Electronics; ComponentLink5URL: https://datasheet.ciiva.com/16885/70182998-16885945.pdf?src-supplier=Allied+Electronics; ComponentLink5Description: https://datasheet.ciiva.com/16885/70182998-16885945.pdf?src-supplier=Allied+Electronics
TP302-TP304 = CMP-1672-00008-1: Test Point, 1 Position SMD, RoHS, Tape and Reel; Manufacturer: Keystone Electronics; Plating: Silver; Body Material: Bronze; Supplier: Newark; Supplier Part Number: 59Y8500; Manufacturer Part Number: 5019; RoHS: Yes; Category: Connectors; Stock: 11269; Pricing: 1=0.411, 10=0.389, 25=0.285, 50=0.279, 100=0.273, 250=0.246 (USD); Mounting Technology: Surface Mount,PCB; Pins: 1; Contact Plating: Silver; Contact Material: Bronze; Material: Bronze; Packaging: Tape and Reel; Package Quantity: 1; Termination: SMD/SMT; Series: 5019; Height: 0.09inch; Reach SVHC Compliant: No; RoHS Compliant: Yes; Lead Free: Lead Free; ComponentLink1URL: https://datasheet.ciiva.com/14848/m60-2p61-14848437.pdf?src-supplier=Digi-Key; ComponentLink1Description: https://datasheet.ciiva.com/14848/m60-2p61-14848437.pdf?src-supplier=Digi-Key; ComponentLink2URL: https://datasheet.ciiva.com/14848/m60-2p61-14848438.pdf?src-supplier=Digi-Key; ComponentLink2Description: https://datasheet.ciiva.com/14848/m60-2p61-14848438.pdf?src-supplier=Digi-Key; ComponentLink3URL: https://datasheet.ciiva.com/14848/m60-2p61-14848439.pdf?src-supplier=Digi-Key; ComponentLink3Description: https://datasheet.ciiva.com/14848/m60-2p61-14848439.pdf?src-supplier=Digi-Key; ComponentLink4URL: https://datasheet.ciiva.com/16318/m60-2p61-16318395.pdf?src-supplier=Future+Electronics; ComponentLink4Description: https://datasheet.ciiva.com/16318/m60-2p61-16318395.pdf?src-supplier=Future+Electronics; ComponentLink5URL: https://datasheet.ciiva.com/16885/70182998-16885945.pdf?src-supplier=Allied+Electronics; ComponentLink5Description: https://datasheet.ciiva.com/16885/70182998-16885945.pdf?src-supplier=Allied+Electronics
U300 = CMP-1556-00003-2: 1.9 A Bipolar Stepper Motor Driver with On-Chip 1 / 8 Microstepping Indexer (Step / Dir Ctrl), -40 to 85 degC, 28-pin HTSSOP (PWP), Green (RoHS & no Sb/Br); Peak Output Current(A): 1.9; Thermal Shutdown: TRUE; PartNumber: DRV8811PWPR; Package Reference: PWP0028C; PackageDescription: 28-Pin Plastic Small Outline, Body 9.70 x 4.40 mm, Pitch 0.65 mm; Code_JEDEC: MO-153; ComponentLink1Description: Manufacturer URL; PackageVersion: 4073225-6/I, 05/2011; ComponentLink3Description: Package Specification; ComponentLink1URL: http://www.ti.com/; ComponentLink2Description: Datasheet; DatasheetVersion: SLVS865G; Eco-Plan: Green (RoHS & no Sb/Br); ComponentLink3URL: http://www.ti.com/litv/pdf/mpds373; Mounting Technology: Surface Mount; ComponentLink2URL: http://www.ti.com/general/docs/lit/getliterature.tsp?genericPartNumber=DRV8811&fileType=pdf

## Sheet 04_Mechanical.SchDoc: Mechanicals
size A; Revision: A; SheetNumber: 4; SheetTotal: 4; ECE315_Project_Name: ECE453 Base Project
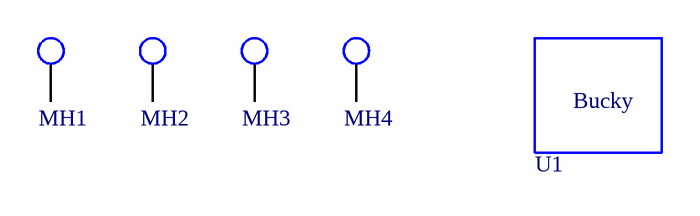
[diagram p2: 04_Mechanical.SchDoc]

### Parts
MH1  MHOLE_2_55MM  [MHOLE_2_55MM]  (value not drawn)  (no BOM)
MH2  MHOLE_2_55MM  [MHOLE_2_55MM]  (value not drawn)  (no BOM)
MH3  MHOLE_2_55MM  [MHOLE_2_55MM]  (value not drawn)  (no BOM)
MH4  MHOLE_2_55MM  [MHOLE_2_55MM]  (value not drawn)  (no BOM)
U1  Bucky  [WalkingBucky]  (value not drawn)  (no BOM)

### Nets

Not connected (* = marked no-connect by the designer): MH1 1; MH2 1; MH3 1; MH4 1

### Notes on the sheet
- Title:
- Size:
- A
- Project
- Rev:
- Sheet:
- of
- College of Engineering
- 1415 Engineering Drive
- Madison, WI 53706

### Library data of the parts
MH1-MH4 = MHOLE_2_55MM: Mounting Holde; Manufacturer Part Number: UW MTHOLE
U1 = Bucky: Bucky Badger Image; Manufacturer Part Number: UW Bucky

## Nets that join several sheets
3.3V: 02_Connectors (5 pins), 03_ICs (13 pins)
GND: 02_Connectors (16 pins), 03_ICs (32 pins)
Dir: 02_Connectors (J201.2), 03_ICs (R304.2 TP301.1)
Step: 02_Connectors (J201.3), 03_ICs (R303.2 TP300.1)